# Altium schematic sheet Temp_hum_sensor.SchDoc
size A4
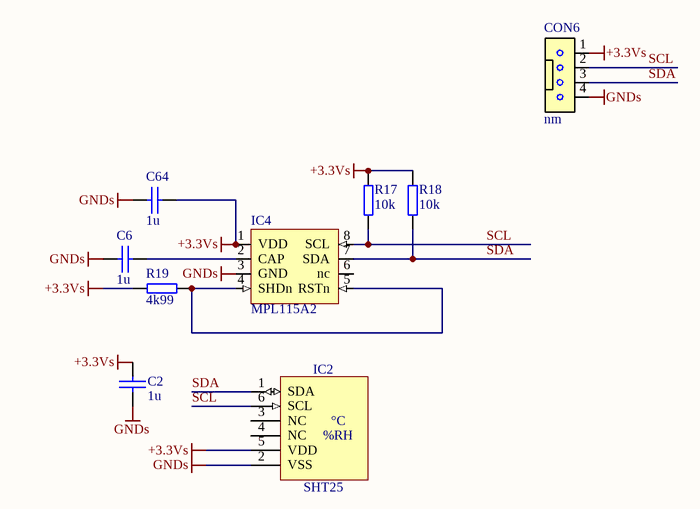
[diagram p0: Temp_hum_sensor.SchDoc]

## Parts
C2  1u  [0603C]
C6  1u  [0603C]
C64  1u  [0603C]
CON6  nm  [WZ04S]
IC2  SHT25  [SENSIRION_SHT2X]
IC4  MPL115A2  [LGA8]
R17  10k  [0402R]
R18  10k  [0402R]
R19  4k99  [0603R]

## Nets
+3.3Vs: C2.2 C64.2 CON6.1 IC2.5(VDD) IC4.1(VDD) R17.2 R18.2 R19.2
GNDs: C2.1 C6.1 C64.1 CON6.4 IC2.2(VSS) IC4.3(GND)
SCL: CON6.2 IC2.6(SCL) IC4.8(SCL) R17.1
SDA: CON6.3 IC2.1(SDA) IC4.7(SDA) R18.1
NetC6_2: C6.2 IC4.2(CAP)
NetIC4_4: IC4.4(SHDn) IC4.5(RSTn) R19.1

Not connected (* = marked no-connect by the designer): IC2 3(NC) 4(NC); IC4 6(nc)

## Notes on the sheet
- (in symbol SHT25) °C; %RH

## Library data of the parts
C2 C6 C64 = CAP_SMD_0603: Capacitor SMD; Supplier 1: Digi-Key; Supplier Part Number 1: 490-1524-2-ND
CON6 = CON_4_2.54_key: 2.54mm crimped terminal header
IC2 = SHT25: Humidity and Temperature Sensor IC; Part Description: I2C Digital Humidity 0 – 100% RH and Temperature -40°C to +125°C Sensor; Manufacturer: SENSIRION; Table: Sensors; Part Number: SHT25; Component Kind: Standard; Component Type: Standard; Device: SHT25; PackageDescription: SON, 1.00mm, Pitch; 6 Pin, 3.00mm W X 3.00mm L X 1.20mm H body (W/Thermal Tab 1.40 X 2.3mm), SEMIRION DFN; Manufacturer Part Number: SHT25; Pin Count: 6; Case: SON6; Mounted: Yes; Socket: No; SMD: Yes; ComponentHeight: 1.2mm; HelpURL: \\cern.ch\dfs\Applications\Altium\Datasheets\SHT25.pdf; Author: CERN DEM JLC; CreateDate: 2012-04-19; LatestRevisionDate: 2012-04-19
IC4 = SENS_MPL115A2: Miniature I2C Digital Barometer
R17 R18 = RES_0402: SMD Resistor; Supplier 1: Newark; Supplier Part Number 1: 59M6691
R19 = RES_0603: SMD Resistor; Supplier 1: Newark; Supplier Part Number 1: 39K0073